# Altium project Argon_RevB_PCBA.PrjPcb (part 2 of 2)

## Sheet Display Driver.SchDoc
size B
Used 9 times, as channels D1, D2, D3, D4, D5, D6, D7, D8, D9. Parts and nets are listed once, with the designators drawn on the sheet.
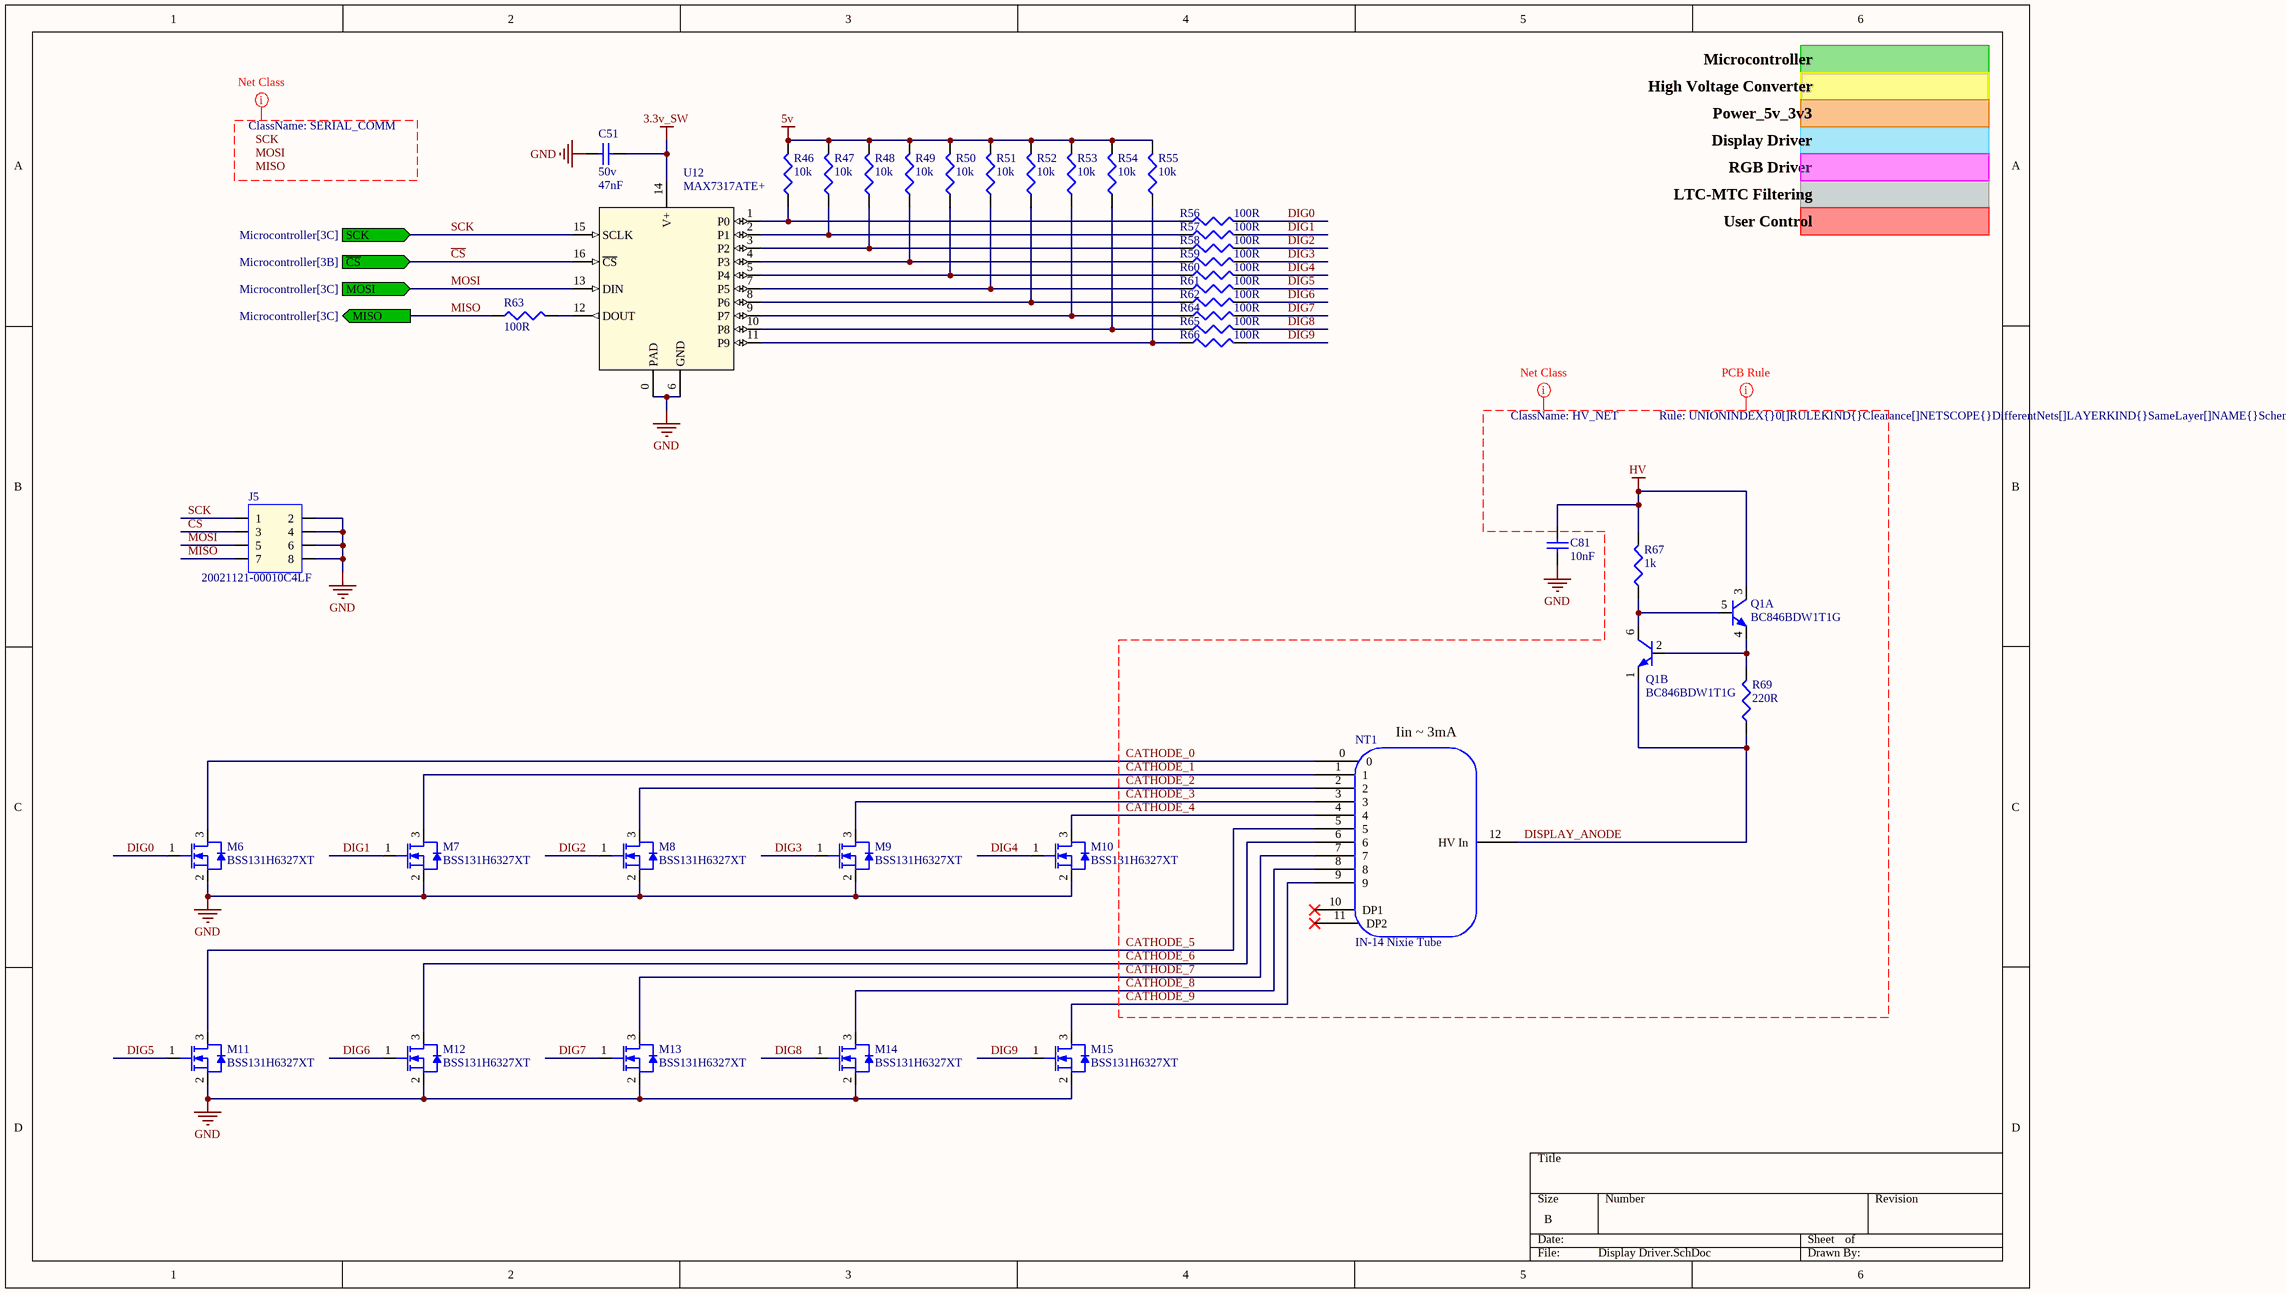
[diagram p8: Display Driver.SchDoc]

### Parts
C51  Voltage: 50v  [CAP0603R]  (hidden comment: 47nF)
C81  10nF  [CAP0805R]
J5  20021121-00010C4LF  [2x4 SMD Header 1.27mm]
M6  BSS131H6327XT  [SOT23-3 REFLOW]
M7  BSS131H6327XT  [SOT23-3 REFLOW]
M8  BSS131H6327XT  [SOT23-3 REFLOW]
M9  BSS131H6327XT  [SOT23-3 REFLOW]
M10  BSS131H6327XT  [SOT23-3 REFLOW]
M11  BSS131H6327XT  [SOT23-3 REFLOW]
M12  BSS131H6327XT  [SOT23-3 REFLOW]
M13  BSS131H6327XT  [SOT23-3 REFLOW]
M14  BSS131H6327XT  [SOT23-3 REFLOW]
M15  BSS131H6327XT  [SOT23-3 REFLOW]
NT1  IN-14 Nixie Tube  [IN-14 Nixie Tube]
Q1  BC846BDW1T1G  [SC70]  (parts A,B of 2)
R46  10k  [RES0402R]
R47  10k  [RES0402R]
R48  10k  [RES0402R]
R49  10k  [RES0402R]
R50  10k  [RES0402R]
R51  10k  [RES0402R]
R52  10k  [RES0402R]
R53  10k  [RES0402R]
R54  10k  [RES0402R]
R55  10k  [RES0402R]
R56  100R  [RES0402R]
R57  100R  [RES0402R]
R58  100R  [RES0402R]
R59  100R  [RES0402R]
R60  100R  [RES0402R]
R61  100R  [RES0402R]
R62  100R  [RES0402R]
R63  100R  [RES0402R]
R64  100R  [RES0402R]
R65  100R  [RES0402R]
R66  100R  [RES0402R]
R67  1k  [RES0402R]
R69  220R  [RES0603R]
U12  MAX7317ATE+  [TQFN-16]

### Ports
MISO (out, see Microcontroller[3C]), MOSI (in, see Microcontroller[3C]), SCK (in, see Microcontroller[3C]), ~{CS} (in, see Microcontroller[3B])

### Nets
3.3v_SW: C51.2 U12.14(V+)
5v: R46.2 R47.2 R48.2 R49.2 R50.2 R51.2 R52.2 R53.2 R54.2 R55.2
GND: C51.1 C81.2 J5.2 J5.4 J5.6 J5.8 M6.2(SOURCE) M7.2(SOURCE) M8.2(SOURCE) M9.2(SOURCE) M10.2(SOURCE) M11.2(SOURCE) M12.2(SOURCE) M13.2(SOURCE) M14.2(SOURCE) M15.2(SOURCE) U12.0(PAD) U12.6(GND)
HV: C81.1 Q1.3(E1) R67.2
~{CS}: J5.3 U12.16(~{CS}) ; port ~{CS}
CATHODE_0: M6.3(DRAIN) NT1.0
CATHODE_1: M7.3(DRAIN) NT1.1
CATHODE_2: M8.3(DRAIN) NT1.2
CATHODE_3: M9.3(DRAIN) NT1.3
CATHODE_4: M10.3(DRAIN) NT1.4
CATHODE_5: M11.3(DRAIN) NT1.5
CATHODE_6: M12.3(DRAIN) NT1.6
CATHODE_7: M13.3(DRAIN) NT1.7
CATHODE_8: M14.3(DRAIN) NT1.8
CATHODE_9: M15.3(DRAIN) NT1.9
DIG0: M6.1(GATE) R56.2
DIG1: M7.1(GATE) R57.2
DIG2: M8.1(GATE) R58.2
DIG3: M9.1(GATE) R59.2
DIG4: M10.1(GATE) R60.2
DIG5: M11.1(GATE) R61.2
DIG6: M12.1(GATE) R62.2
DIG7: M13.1(GATE) R64.2
DIG8: M14.1(GATE) R65.2
DIG9: M15.1(GATE) R66.2
DISPLAY_ANODE: NT1.12(HV_In) Q1.1(C2) R69.1
MISO: J5.7 R63.1 ; port MISO
MOSI: J5.5 U12.13(DIN) ; port MOSI
SCK: J5.1 U12.15(SCLK) ; port SCK
NetQ1_2: Q1.2(B2) Q1.4(C1) R69.2
NetQ1_5: Q1.5(B1) Q1.6(E2) R67.1
NetR46_1: R46.1 R56.1 U12.1(P0)
NetR47_1: R47.1 R57.1 U12.2(P1)
NetR48_1: R48.1 R58.1 U12.3(P2)
NetR49_1: R49.1 R59.1 U12.4(P3)
NetR50_1: R50.1 R60.1 U12.5(P4)
NetR51_1: R51.1 R61.1 U12.7(P5)
NetR52_1: R52.1 R62.1 U12.8(P6)
NetR53_1: R53.1 R64.1 U12.9(P7)
NetR54_1: R54.1 R65.1 U12.10(P8)
NetR55_1: R55.1 R66.1 U12.11(P9)
NetR63_2: R63.2 U12.12(DOUT)

Not connected (* = marked no-connect by the designer): NT1 10(DP1)* 11(DP2)*

### Channels
D1: designators end in .1; ports MISO=MISO MOSI=MOSI SCK=SCK ~{CS}=~{CS}_D1
D2: designators end in .2; ports MISO=MISO MOSI=MOSI SCK=SCK ~{CS}=~{CS}_D2
D3: designators end in .3; ports MISO=MISO MOSI=MOSI SCK=SCK ~{CS}=~{CS}_D3
D4: designators end in .4; ports MISO=MISO MOSI=MOSI SCK=SCK ~{CS}=~{CS}_D4
D5: designators end in .5; ports MISO=MISO MOSI=MOSI SCK=SCK ~{CS}=~{CS}_D5
D6: designators end in .6; ports MISO=MISO MOSI=MOSI SCK=SCK ~{CS}=~{CS}_D6
D7: designators end in .7; ports MISO=MISO MOSI=MOSI SCK=SCK ~{CS}=~{CS}_D7
D8: designators end in .8; ports MISO=MISO MOSI=MOSI SCK=SCK ~{CS}=~{CS}_D8
D9: designators end in .9; ports MISO=MISO MOSI=MOSI SCK=SCK ~{CS}=~{CS}_D9

### Layout directives
net class HV_NET: CATHODE_0, CATHODE_1, CATHODE_2, CATHODE_3, CATHODE_4, CATHODE_5, CATHODE_6, CATHODE_7, CATHODE_8, CATHODE_9, DISPLAY_ANODE, HV
rule Clearance Constraint [Clearance = 10mil]: CATHODE_0, CATHODE_1, CATHODE_2, CATHODE_3, CATHODE_4, CATHODE_5, CATHODE_6, CATHODE_7, CATHODE_8, CATHODE_9, DISPLAY_ANODE, HV
net class SERIAL_COMM: MISO, MOSI, SCK

### Notes on the sheet
- Microcontroller
- High Voltage Converter
- Display Driver
- Power_5v_3v3
- RGB Driver
- LTC-MTC Filtering
- User Control
- (near NT1) Iin ~ 3mA
- Labels drawn without touching a wire or pin: MISO, MOSI, SCK

### Library data of the parts
C51 = 47nF 50v (0603): Tolerance: 10%; MFG_PN: VJ0603Y473KXACW1BC; MFG: VISHAY; Value: 47nF
C81 = 10nF 250v (0805): Tolerance: 10%; MFG_PN: GRM21BR72E103KW03L; MFG: Murata; Voltage: 250v; LOAD: NL; Value: 10nF
J5 = 2x4 Header SMD (1.27mm): LOAD: NL; MFG: FCI; CURRENT: 1A; MFG_PN: 20021121-00010C4LF
M6-M15 = BSS131H6327XT: NFET_SINGLE_100mA_240v; MFG: INFINEON; VDS: 240v; VGS: 20v; RDS: 14R; CURRENT: 0.1A; MFG_PN: BSS131H6327XT
Q1 = BC846BDW1T1G: BJT, Dual NPN, 65v, 100mA; MFG: ON Semiconductor; VCBO: 80v; MFG_PN: BC846BDW1T1G; CURRENT: 100mA; VCEO: 65V
R46-R55 = 10k (0402): as R2 on sheet Microcontroller; Value: 10k
R56-R66 = 100R (0402): as R4 on sheet Microcontroller; Value: 100R
R67 = 1k (0402): as R86 on sheet Microcontroller; Value: 1k
R69 = 220R (0603): Tolerance: 1%; POWER: 0.1W; MFG_PN: CRCW0603220RFKEB; MFG: Vishay; Load: NL; Value: 220R
U12 = MAX7317ATE+: Port Expander, 10-bit, SPI; MFG: MAXIM; CHANNELS: 10; V_SUPPLY: 3.6v; VOUT_MAX: 7v; IOUT: 24mA; MFG_PN: MAX7317ATE+; COMMUNICATION: SPI

## Sheet RGB Driver.SchDoc
size B
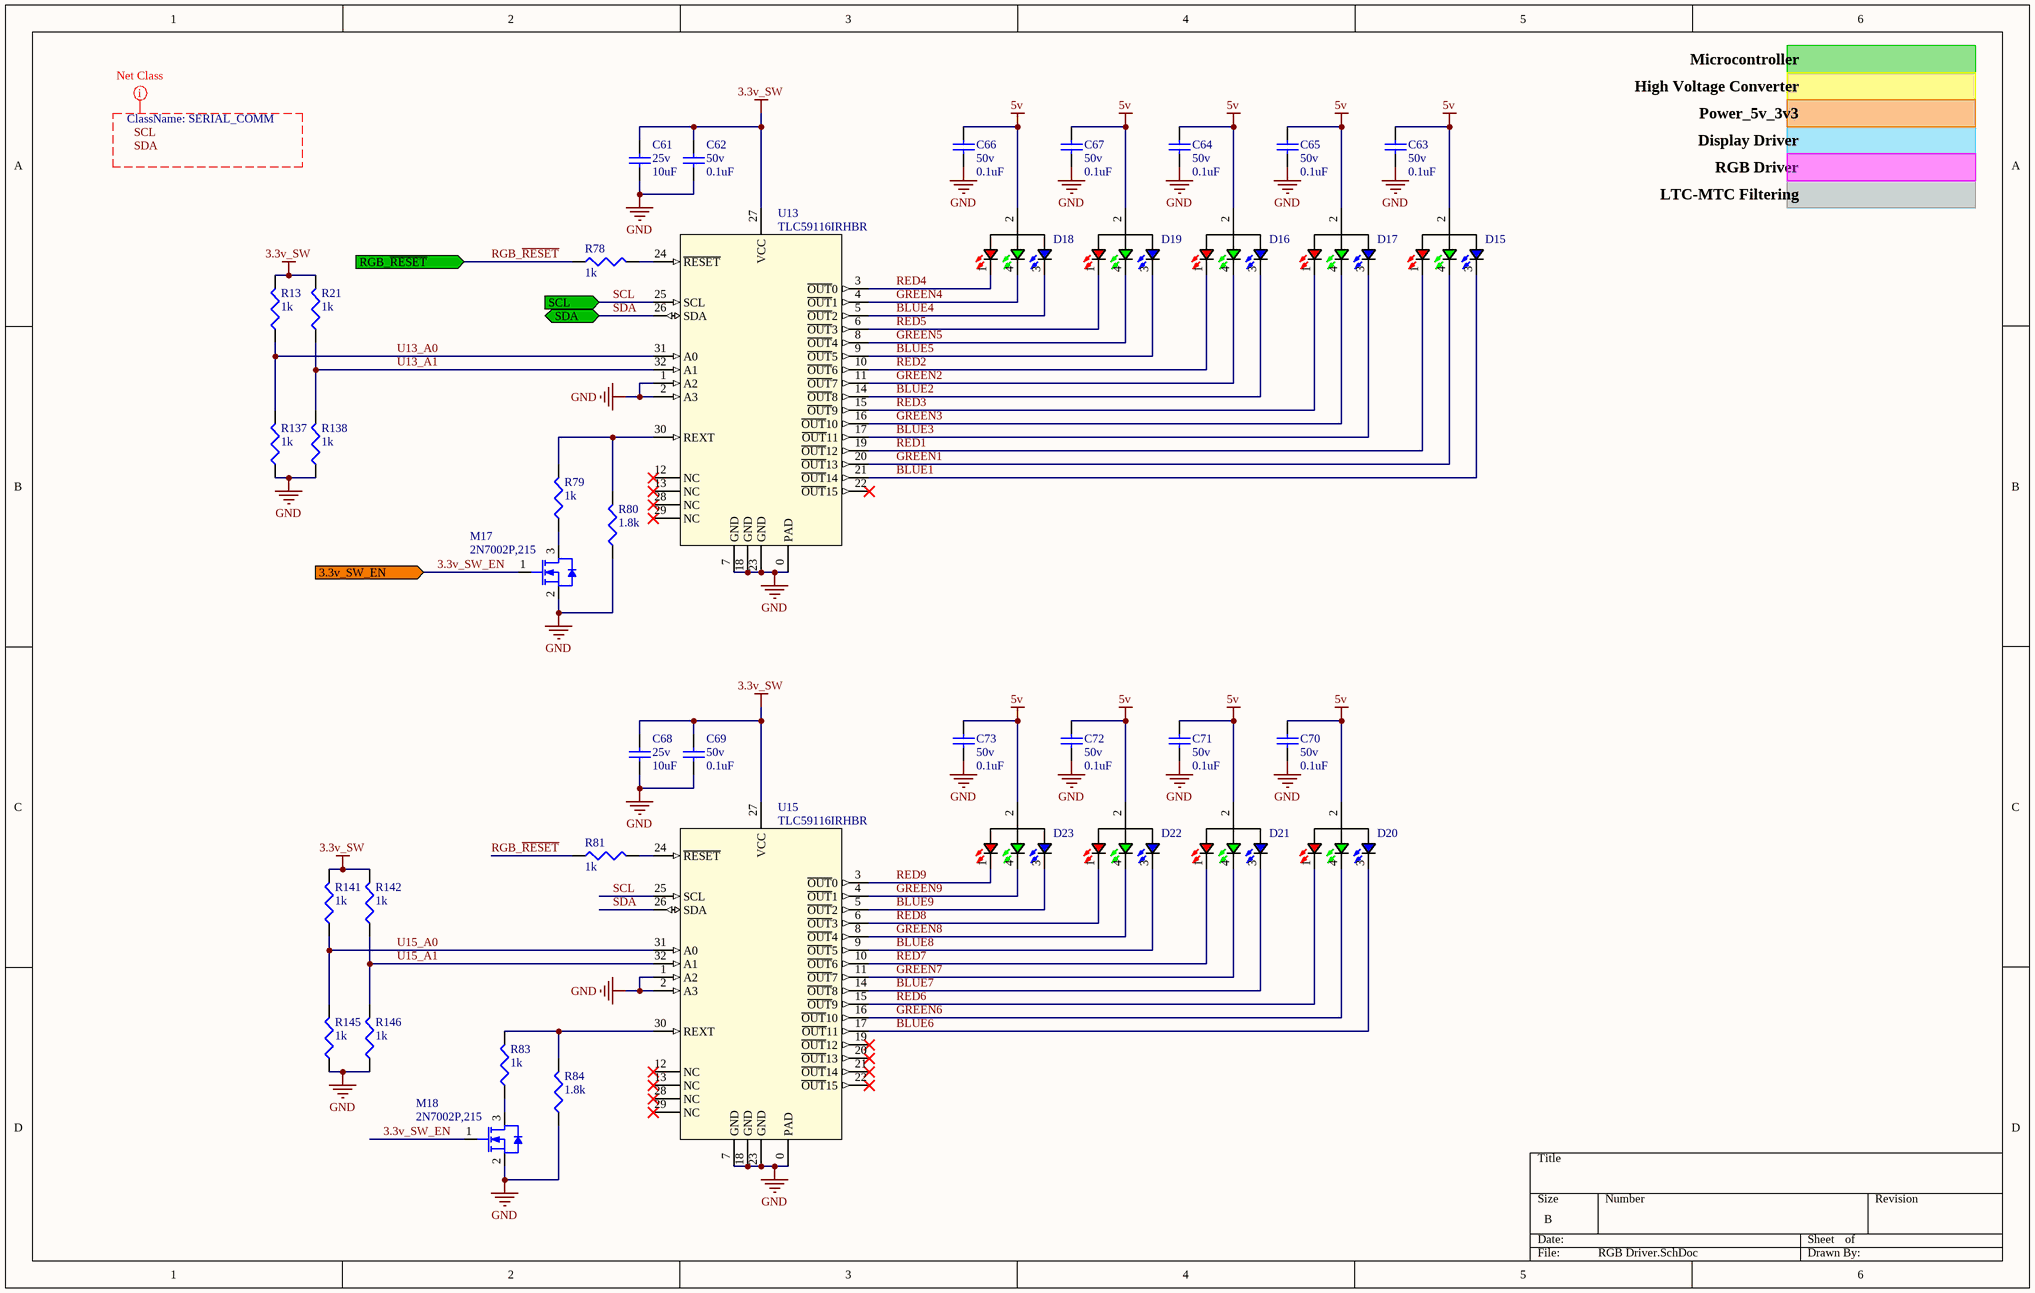
[diagram p9: RGB Driver.SchDoc]

### Parts
C61  Voltage: 25v  [CAP1206R]  (hidden comment: 10uF)
C62  Voltage: 50v  [CAP0603R]  (hidden comment: 0.1uF)
C63  Voltage: 50v  [CAP0603R]  (hidden comment: 0.1uF)
C64  Voltage: 50v  [CAP0603R]  (hidden comment: 0.1uF)
C65  Voltage: 50v  [CAP0603R]  (hidden comment: 0.1uF)
C66  Voltage: 50v  [CAP0603R]  (hidden comment: 0.1uF)
C67  Voltage: 50v  [CAP0603R]  (hidden comment: 0.1uF)
C68  Voltage: 25v  [CAP1206R]  (hidden comment: 10uF)
C69  Voltage: 50v  [CAP0603R]  (hidden comment: 0.1uF)
C70  Voltage: 50v  [CAP0603R]  (hidden comment: 0.1uF)
C71  Voltage: 50v  [CAP0603R]  (hidden comment: 0.1uF)
C72  Voltage: 50v  [CAP0603R]  (hidden comment: 0.1uF)
C73  Voltage: 50v  [CAP0603R]  (hidden comment: 0.1uF)
D15  XZMDKCBDDG45S-9  [XZMDKCBDDG45S-9]  (value not drawn)
D16  XZMDKCBDDG45S-9  [XZMDKCBDDG45S-9]  (value not drawn)
D17  XZMDKCBDDG45S-9  [XZMDKCBDDG45S-9]  (value not drawn)
D18  XZMDKCBDDG45S-9  [XZMDKCBDDG45S-9]  (value not drawn)
D19  XZMDKCBDDG45S-9  [XZMDKCBDDG45S-9]  (value not drawn)
D20  XZMDKCBDDG45S-9  [XZMDKCBDDG45S-9]  (value not drawn)
D21  XZMDKCBDDG45S-9  [XZMDKCBDDG45S-9]  (value not drawn)
D22  XZMDKCBDDG45S-9  [XZMDKCBDDG45S-9]  (value not drawn)
D23  XZMDKCBDDG45S-9  [XZMDKCBDDG45S-9]  (value not drawn)
M17  2N7002P,215  [SOT23-3M]
M18  2N7002P,215  [SOT23-3M]
R13  1k  [RES0402R]
R21  1k  [RES0402R]
R78  1k  [RES0402R]
R79  1k  [RES0402R]
R80  1.8k  [RES0402R]
R81  1k  [RES0402R]
R83  1k  [RES0402R]
R84  1.8k  [RES0402R]
R137  1k  [RES0402R]
R138  1k  [RES0402R]
R141  1k  [RES0402R]
R142  1k  [RES0402R]
R145  1k  [RES0402R]
R146  1k  [RES0402R]
U13  TLC59116IRHBR  [QFN32]
U15  TLC59116IRHBR  [QFN32]

### Ports
3.3v_SW_EN (in), RGB_~{RESET} (in), SCL (in), SDA (bidir)

### Nets
3.3v_SW: C61.1 C62.2 C68.1 C69.2 R13.2 R21.2 R141.2 R142.2 U13.27(VCC) U15.27(VCC)
5v: C63.1 C64.1 C65.1 C66.1 C67.1 C70.1 C71.1 C72.1 C73.1 D15.2(COMMON) D16.2(COMMON) D17.2(COMMON) D18.2(COMMON) D19.2(COMMON) D20.2(COMMON) D21.2(COMMON) D22.2(COMMON) D23.2(COMMON)
GND: C61.2 C62.1 C63.2 C64.2 C65.2 C66.2 C67.2 C68.2 C69.1 C70.2 C71.2 C72.2 C73.2 M17.2(SOURCE) M18.2(SOURCE) R80.1 R84.1 R137.1 R138.1 R145.1 R146.1 U13.0(PAD) U13.1(A2) U13.2(A3) U13.7(GND) U13.18(GND) U13.23(GND) U15.0(PAD) U15.1(A2) U15.2(A3) U15.7(GND) U15.18(GND) U15.23(GND)
3.3v_SW_EN: M17.1(GATE) M18.1(GATE) ; port 3.3v_SW_EN
BLUE1: D15.3(B) U13.21(~{OUT}14)
BLUE2: D16.3(B) U13.14(~{OUT}8)
BLUE3: D17.3(B) U13.17(~{OUT}11)
BLUE4: D18.3(B) U13.5(~{OUT}2)
BLUE5: D19.3(B) U13.9(~{OUT}5)
BLUE6: D20.3(B) U15.17(~{OUT}11)
BLUE7: D21.3(B) U15.14(~{OUT}8)
BLUE8: D22.3(B) U15.9(~{OUT}5)
BLUE9: D23.3(B) U15.5(~{OUT}2)
GREEN1: D15.4(G) U13.20(~{OUT}13)
GREEN2: D16.4(G) U13.11(~{OUT}7)
GREEN3: D17.4(G) U13.16(~{OUT}10)
GREEN4: D18.4(G) U13.4(~{OUT}1)
GREEN5: D19.4(G) U13.8(~{OUT}4)
GREEN6: D20.4(G) U15.16(~{OUT}10)
GREEN7: D21.4(G) U15.11(~{OUT}7)
GREEN8: D22.4(G) U15.8(~{OUT}4)
GREEN9: D23.4(G) U15.4(~{OUT}1)
RED1: D15.1(R) U13.19(~{OUT}12)
RED2: D16.1(R) U13.10(~{OUT}6)
RED3: D17.1(R) U13.15(~{OUT}9)
RED4: D18.1(R) U13.3(~{OUT}0)
RED5: D19.1(R) U13.6(~{OUT}3)
RED6: D20.1(R) U15.15(~{OUT}9)
RED7: D21.1(R) U15.10(~{OUT}6)
RED8: D22.1(R) U15.6(~{OUT}3)
RED9: D23.1(R) U15.3(~{OUT}0)
RGB_~{RESET}: R78.1 R81.1 ; port RGB_~{RESET}
SCL: U13.25(SCL) U15.25(SCL) ; port SCL
SDA: U13.26(SDA) U15.26(SDA) ; port SDA
U13_A0: R13.1 R137.2 U13.31(A0)
U13_A1: R21.1 R138.2 U13.32(A1)
U15_A0: R141.1 R145.2 U15.31(A0)
U15_A1: R142.1 R146.2 U15.32(A1)
NetM17_3: M17.3(DRAIN) R79.1
NetM18_3: M18.3(DRAIN) R83.1
NetR78_2: R78.2 U13.24(~{RESET})
NetR79_2: R79.2 R80.2 U13.30(REXT)
NetR81_2: R81.2 U15.24(~{RESET})
NetR83_2: R83.2 R84.2 U15.30(REXT)

Not connected (* = marked no-connect by the designer): U13 12(NC)* 13(NC)* 22(~{OUT}15)* 28(NC)* 29(NC)*; U15 12(NC)* 13(NC)* 19(~{OUT}12)* 20(~{OUT}13)* 21(~{OUT}14)* 22(~{OUT}15)* 28(NC)* 29(NC)*

### Layout directives
net class SERIAL_COMM: SCL, SDA

### Notes on the sheet
- Microcontroller
- High Voltage Converter
- Display Driver
- Power_5v_3v3
- RGB Driver
- LTC-MTC Filtering
- Labels drawn without touching a wire or pin: SCL, SDA

### Library data of the parts
C61 C68 = 10uF 25v (1206): Tolerance: 10%; MFG_PN: GRJ31CR71E106KE11L; MFG: MURATA; LOAD: NL; Value: 10uF
C62-C67 C69-C73 = 0.1uF 50v (0603): MFG_PN: VJ0603V104ZXAPW1BC; MFG: Vishay; LOAD: NL; Value: 0.1uF
D15-D23 = XZMDKCBDDG45S-9: Reverse Gullwing RGB LED; MFG: SUN LED; VOLTAGE RED: 1.95v; VOLTAGE GREEN: 3.3v; CURRENT: 30mA; MFG_PN: XZMDKCBDDG45S-9; VOLTAGE BLUE: 3.3v
M17 M18 = 2N7002: NFET_SINGLE_360mA_60V; LOAD: NL; MFG: NXP; VDS_MAX: 60v; I_MAX: 360mA; VGS_MAX: 20v; P_MAX: *; RDS_ON: *; MFG_PN: 2N7002P,215
R13 R21 R78 R79 R81 R83 R137 R138 R141 R142 R145 R146 = 1k (0402): Tolerance: 1%; POWER: 63mW; MFG_PN: CRCW04021K00FKED; MFG: Vishay; Load: NL; Value: 1k
R80 R84 = 1.8k (0402): Tolerance: 1%; POWER: 63mW; MFG_PN: CRCW04021K80FKED; MFG: Vishay; Load: NL; Value: 1.8k
U13 U15 = TLC59116IRHBR: LED Driver, 16ch, Individual dimming; MFG: TI; CHANNELS: 16; CURRENT: 120mA; COMM: I2C; MFG_PN: TLC59116IRHBR

## Sheet LTC-MTC Filtering.SchDoc
size B
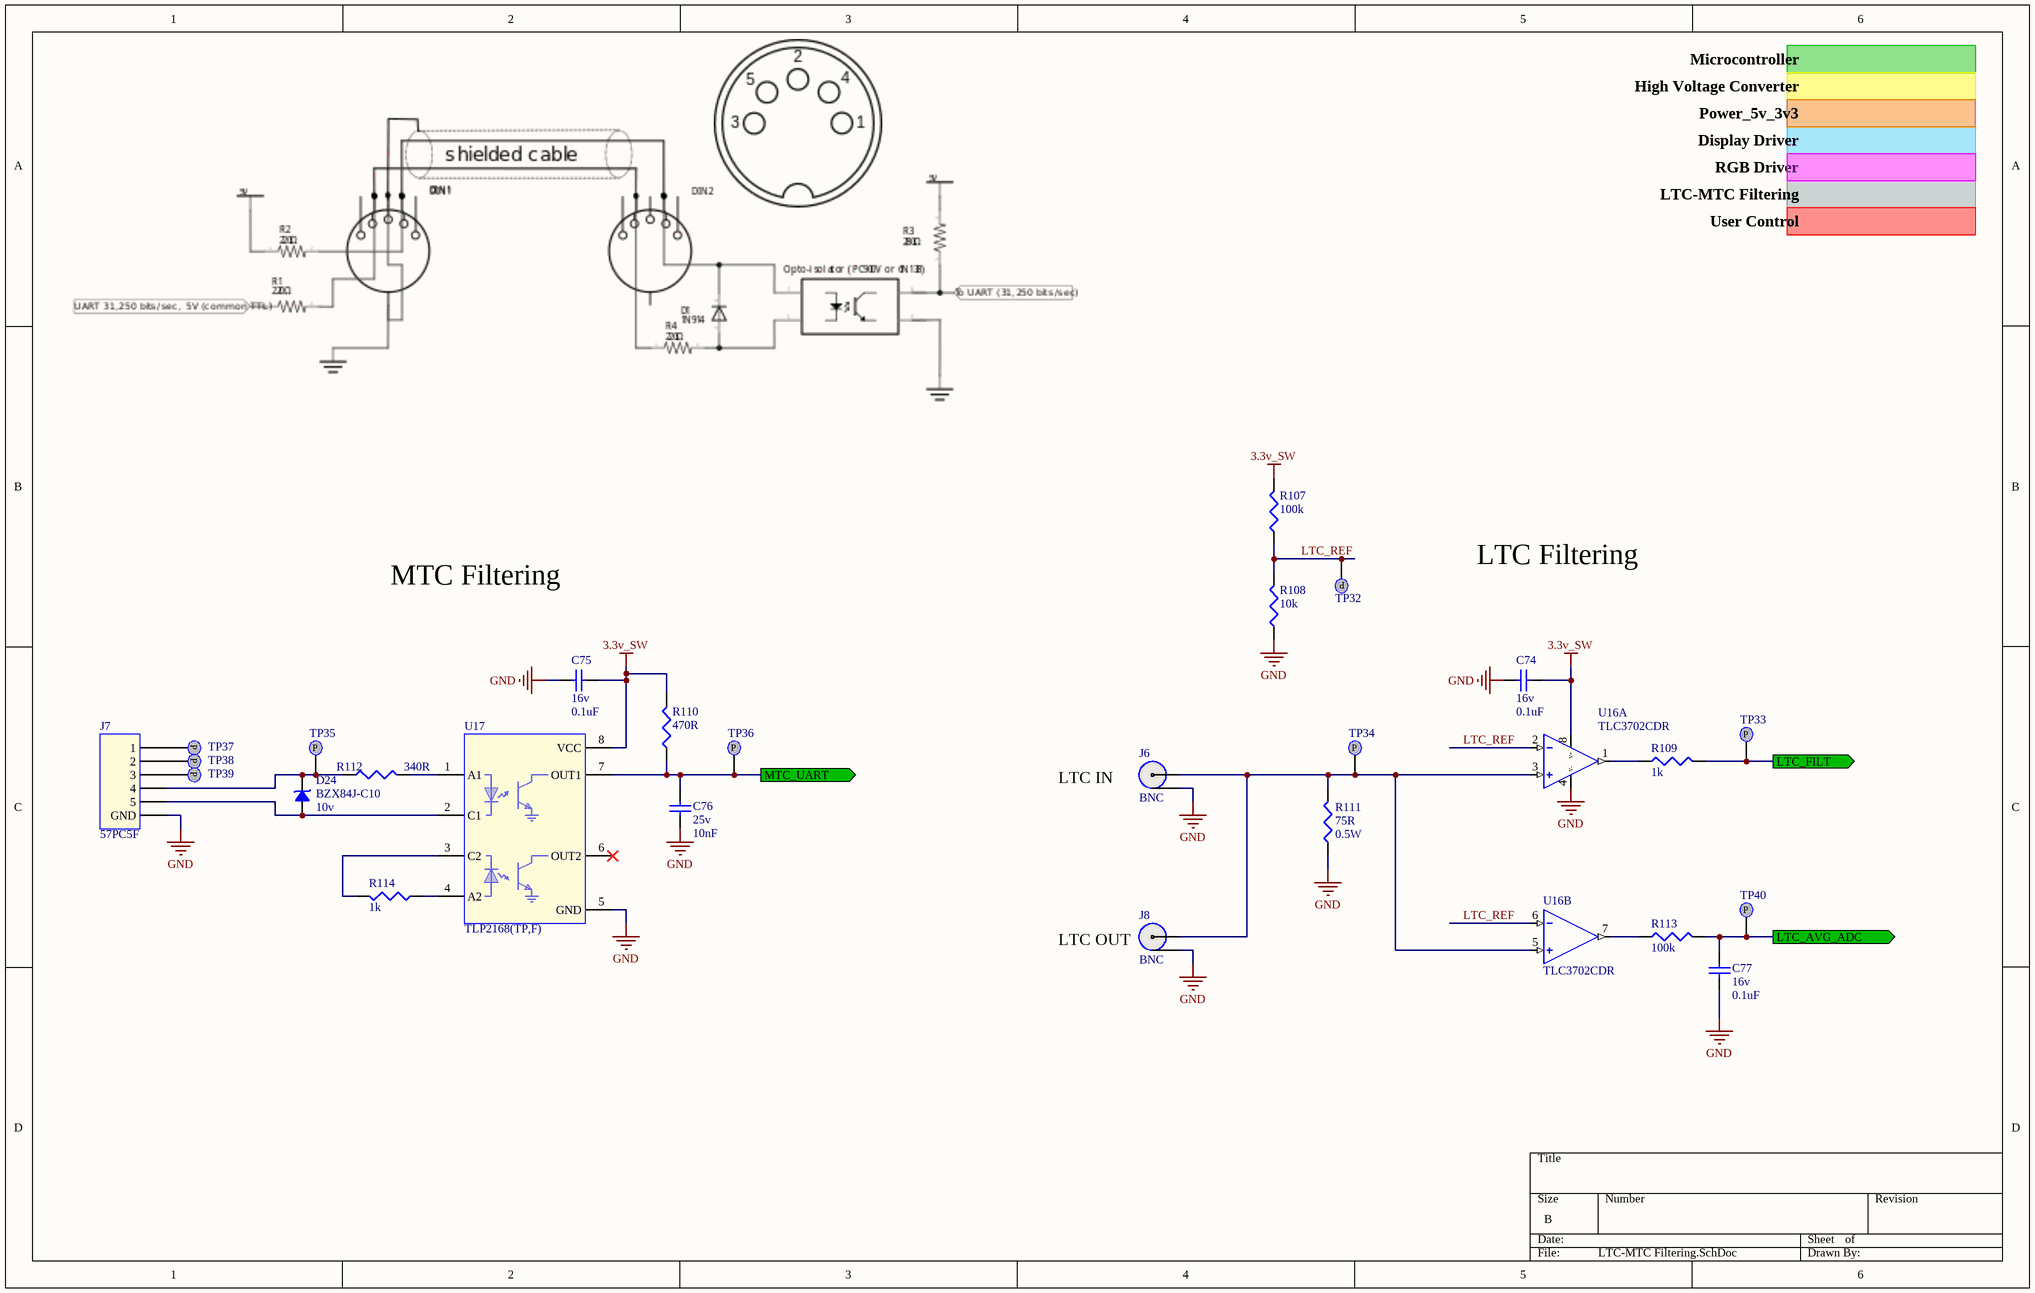
[diagram p10: LTC-MTC Filtering.SchDoc]

### Parts
C74  Voltage: 16v  [CAP0603R]  (hidden comment: 0.1uF)
C75  Voltage: 16v  [CAP0603R]  (hidden comment: 0.1uF)
C76  Voltage: 25v  [CAP0402R]  (hidden comment: 10nF)
C77  Voltage: 16v  [CAP0603R]  (hidden comment: 0.1uF)
D24  BZX84J-C10  OPER_VOLTAGE: 10v  [SOD-323 (SC-90)]
J6  BNC  [BNC Connector]
J7  57PC5F  [57PC5F]
J8  BNC  [BNC Connector]
R107  100k  [RES0402R]
R108  10k  [RES0402R]
R109  1k  [RES0402R]
R110  470R  [RES0603R]
R111  POWER: 0.5W  [RES1210R]  (hidden comment: 75R)
R112  340R  [RES0603R]
R113  100k  [RES0402R]
R114  1k  [RES0402R]
TP32  NONE  [TESTPOINT - 1.5mm Round Pad]  (value not drawn)
TP33  NONE  [TESTPOINT - 1.5mm Round Pad]  (value not drawn)
TP34  NONE  [TESTPOINT - 1.5mm Round Pad]  (value not drawn)
TP35  NONE  [TESTPOINT - 1.5mm Round Pad]  (value not drawn)
TP36  NONE  [TESTPOINT - 1.5mm Round Pad]  (value not drawn)
TP37  NONE  [TESTPOINT - 1.5mm Round Pad]  (value not drawn)
TP38  NONE  [TESTPOINT - 1.5mm Round Pad]  (value not drawn)
TP39  NONE  [TESTPOINT - 1.5mm Round Pad]  (value not drawn)
TP40  NONE  [TESTPOINT - 1.5mm Round Pad]  (value not drawn)
U16  TLC3702CDR  [SOIC-8]  (parts A,B of 2)
U17  TLP2168(TP,F)  [SOIC-8]

### Ports
LTC_AVG_ADC (out), LTC_FILT (out), MTC_UART (out)

### Nets
3.3v_SW: C74.2 C75.2 R107.2 R110.2 U16.8(V+) U17.8(VCC)
GND: C74.1 C75.1 C76.2 C77.2 J6.2 J7.6(GND) J8.2 R108.1 R111.1 U16.4(V-) U17.5(GND)
LTC_REF: R107.1 R108.2 TP32.1 U16.2(-IN_A) U16.6(-IN_B)
NetC76_1: C76.1 R110.1 TP36.1 U17.7(OUT1) ; port MTC_UART
NetC77_1: C77.1 R113.2 TP40.1 ; port LTC_AVG_ADC
NetD24_1: D24.1(K) J7.4 R112.1 TP35.1
NetD24_2: D24.2(A) J7.5 U17.2(C1)
NetJ6_1: J6.1 J8.1 R111.2 TP34.1 U16.3(+IN_A) U16.5(+IN_B)
NetJ7_1: J7.1 TP37.1
NetJ7_2: J7.2 TP38.1
NetJ7_3: J7.3 TP39.1
NetR109_1: R109.1 U16.1(OUT_A)
NetR109_2: R109.2 TP33.1 ; port LTC_FILT
NetR112_2: R112.2 U17.1(A1)
NetR113_1: R113.1 U16.7(OUT_B)
NetR114_1: R114.1 U17.4(A2)
NetR114_2: R114.2 U17.3(C2)

Not connected (* = marked no-connect by the designer): U17 6(OUT2)*

### Notes on the sheet
- Microcontroller
- High Voltage Converter
- Display Driver
- Power_5v_3v3
- RGB Driver
- LTC-MTC Filtering
- User Control
- LTC Filtering
- MTC Filtering
- (near J6) LTC IN
- (near J8) LTC OUT
- (in symbol Testpoint 1.5mm Pad) P

### Library data of the parts
C74 C75 C77 = 0.1uF 16v (0603): MFG_PN: VJ0603Y104JXJPW1BC; MFG: Vishay; LOAD: NL; Value: 0.1uF
C76 = 10nF 25v (0402): Tolerance: 5%; MFG_PN: VJ0402Y103JXXAC; MFG: Vishay; LOAD: NL; Value: 10nF
D24 = BZX84J-C10: Zener, 10v, Single; MFG: NXP; MFG_PN: BZX84J-C10
J6 J8 = BNC Connector: MFG: VITELEC; MFG_PN: VBI211
J7 = 57PC5F: 5-pin DIN Connector; MFG: SWITCHCRAFT; MFG_PN: 57PC5F
R107 R113 = 100k (0402): Tolerance: 1%; POWER: 63mW; MFG_PN: CRCW0402100KFKED; MFG: Vishay; Load: NL; Value: 100k
R108 = 10k (0402): Tolerance: 1%; POWER: 63mW; MFG_PN: CRCW040210K0FKED; MFG: Vishay; Load: NL; Value: 10k
R109 R114 = 1k (0402): as R13 on sheet RGB Driver; Value: 1k
R110 = 470R (0603): Tolerance: 1%; POWER: 0.1W; MFG_PN: CRCW0603470RFKEA; MFG: Vishay; Load: NL; Value: 470R
R111 = 75R (1210): Tolerance: 1%; MFG_PN: CRCW121075R0FKEA; MFG: Vishay; Load: NL; Value: 75R
R112 = 340R (0603): Tolerance: 1%; POWER: 0.1W; MFG_PN: CRCW0603340RFKEA; MFG: Vishay; Load: NL; Value: 340R
TP32-TP40 = Testpoint 1.5mm Pad: 1.5mm Testpoint
U16 = TLC3702CDR: Comparator, Dual, Push-Pull; LOAD: NL; MFG: TI; CHANNELS: 2; SINGLE_SUPPLY: TRUE; VMAX: 16v; OFFSET_VOLTAGE: 5mV; MFG_PN: TLC3702CDR
U17 = TLP2168(TP,F): Optocoupler, Dual, 10MBPS; MFG: TOSHIBA; RATE: 20Mbps; MFG_PN: TLP2168(TP,F)

## Sheet User Control-Sliders.SchDoc
size C
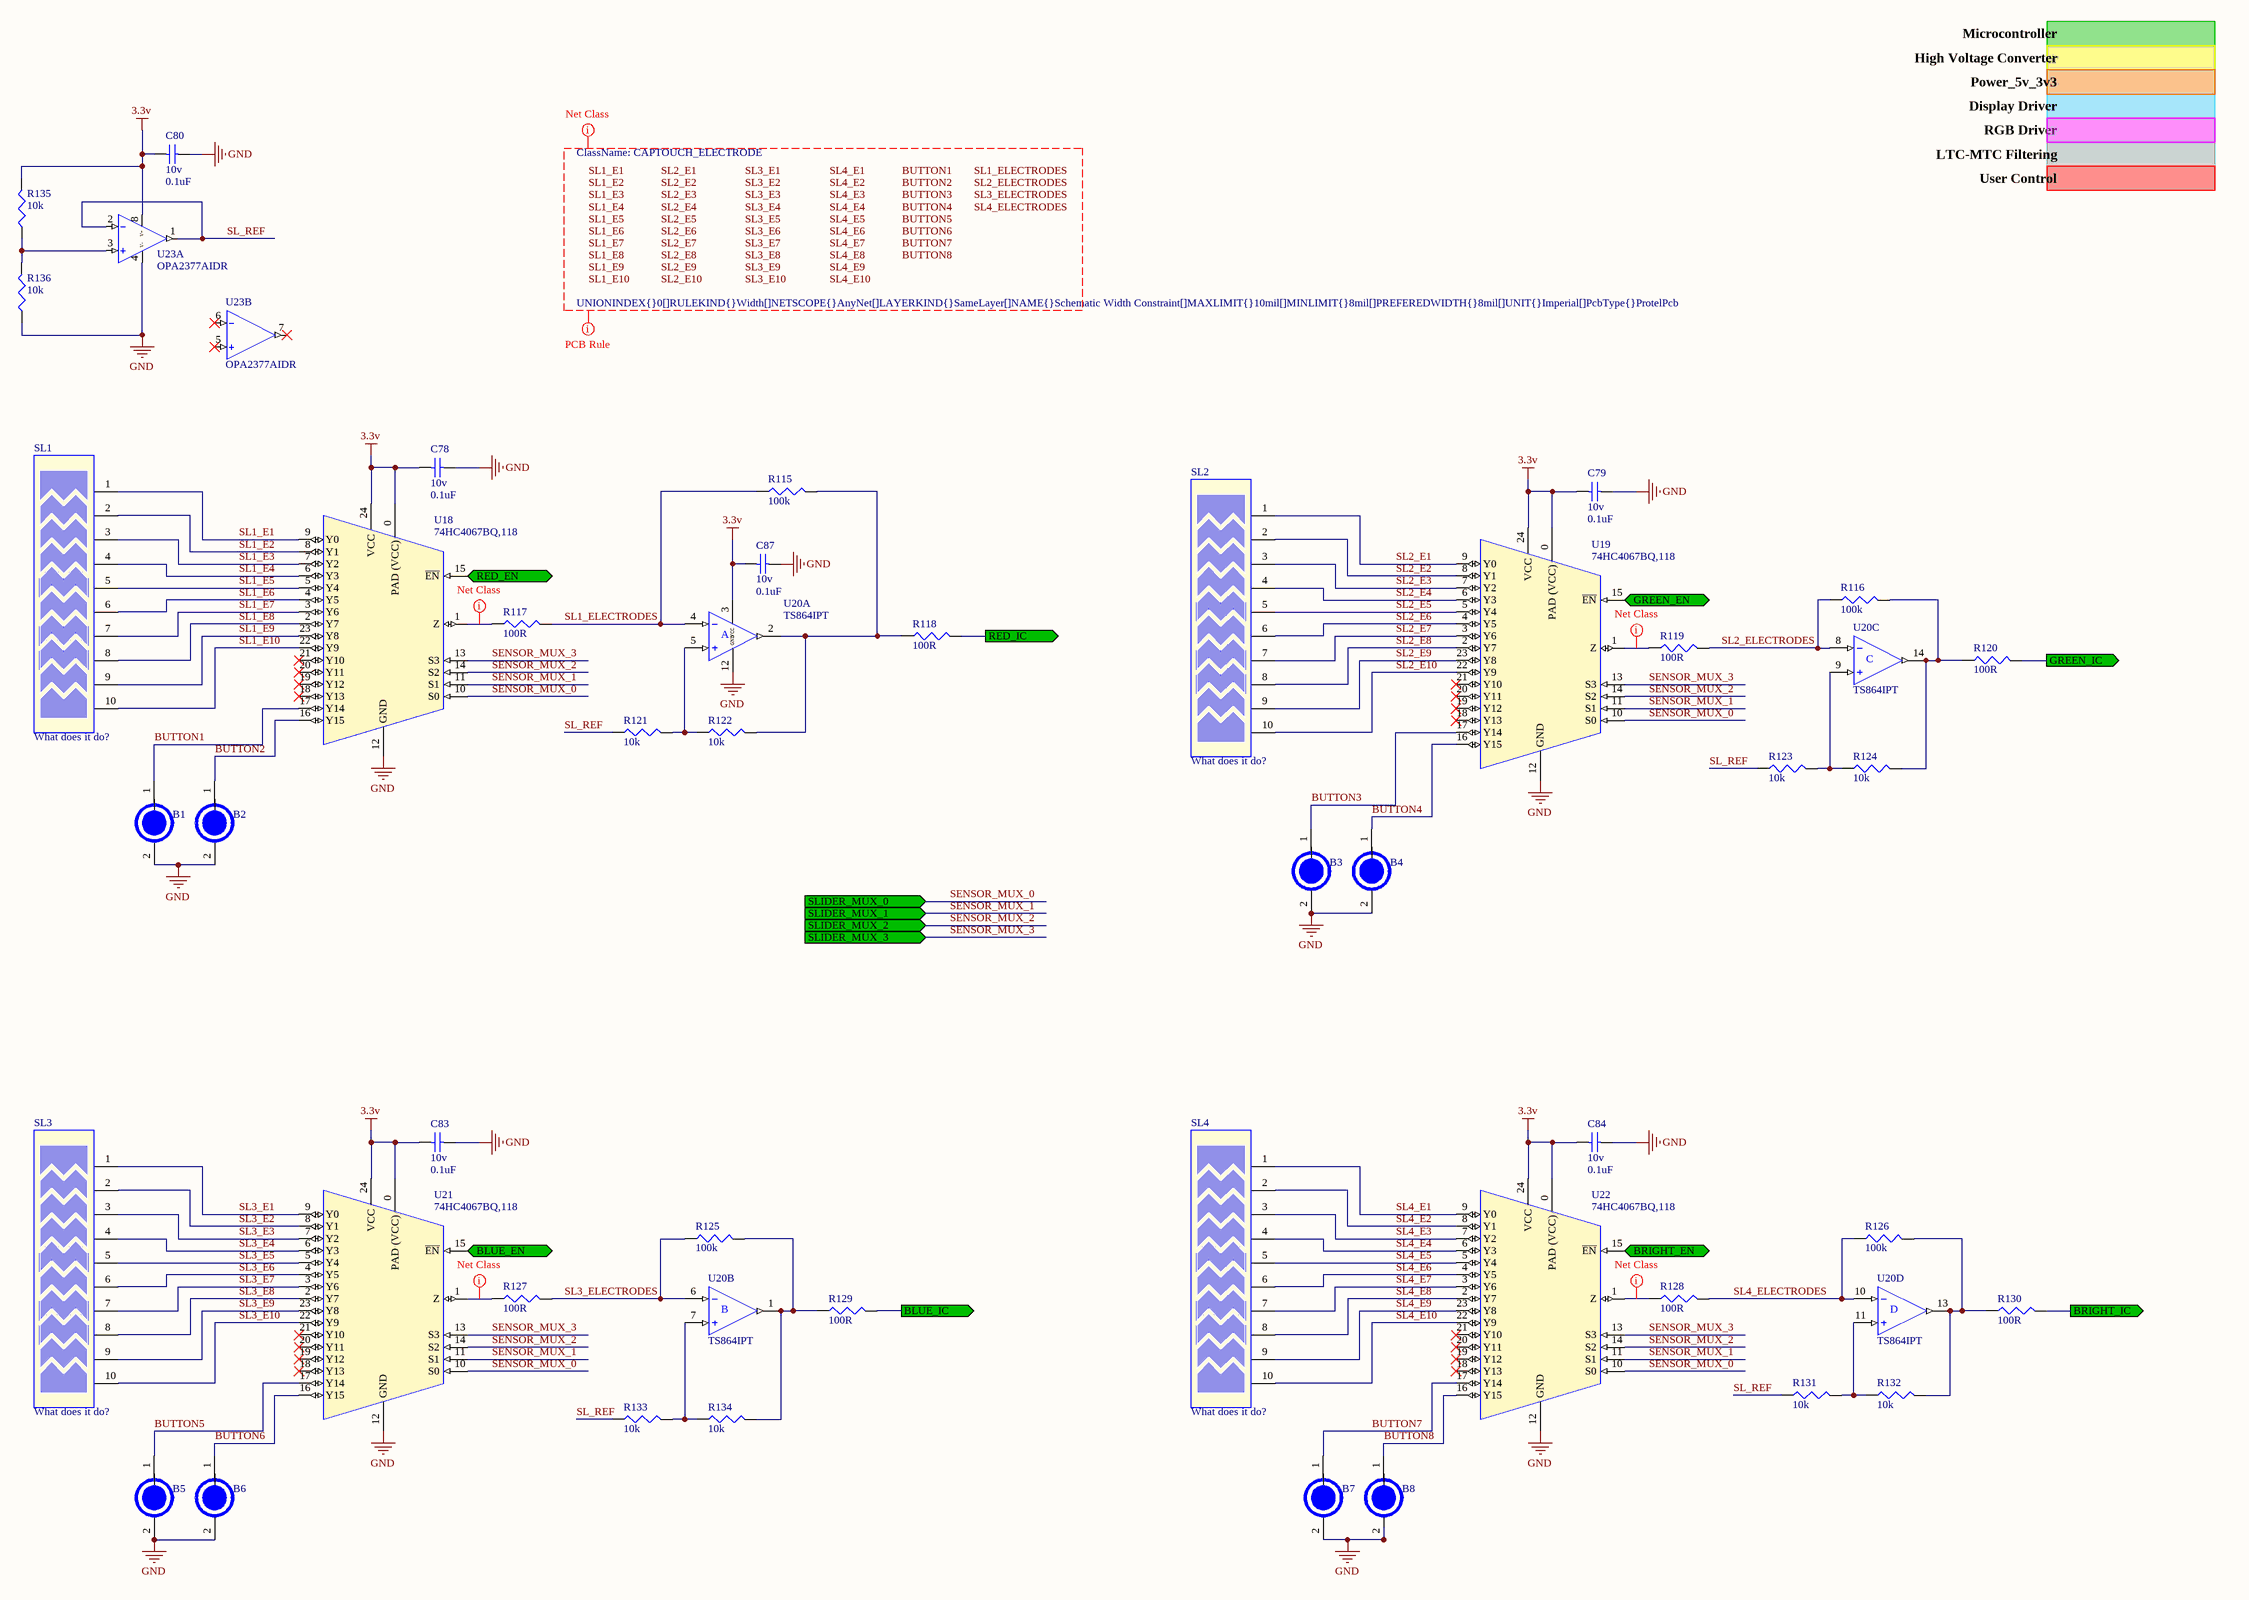
[diagram p11: User Control-Sliders.SchDoc]

### Parts
B1  Cap Touch Button  [Cap Touch Button 10mm]  (value not drawn)  (no BOM)
B2  Cap Touch Button  [Cap Touch Button 10mm]  (value not drawn)  (no BOM)
B3  Cap Touch Button  [Cap Touch Button 10mm]  (value not drawn)  (no BOM)
B4  Cap Touch Button  [Cap Touch Button 10mm]  (value not drawn)  (no BOM)
B5  Cap Touch Button  [Cap Touch Button 10mm]  (value not drawn)  (no BOM)
B6  Cap Touch Button  [Cap Touch Button 10mm]  (value not drawn)  (no BOM)
B7  Cap Touch Button  [Cap Touch Button 10mm]  (value not drawn)  (no BOM)
B8  Cap Touch Button  [Cap Touch Button 10mm]  (value not drawn)  (no BOM)
C78  Voltage: 10v  [CAP0402R]  (hidden comment: 0.1uF)
C79  Voltage: 10v  [CAP0402R]  (hidden comment: 0.1uF)
C80  Voltage: 10v  [CAP0402R]  (hidden comment: 0.1uF)
C83  Voltage: 10v  [CAP0402R]  (hidden comment: 0.1uF)
C84  Voltage: 10v  [CAP0402R]  (hidden comment: 0.1uF)
C87  Voltage: 10v  [CAP0402R]  (hidden comment: 0.1uF)
R115  100k  [RES0402R]
R116  100k  [RES0402R]
R117  100R  [RES0402R]
R118  100R  [RES0402R]
R119  100R  [RES0402R]
R120  100R  [RES0402R]
R121  10k  [RES0402R]
R122  10k  [RES0402R]
R123  10k  [RES0402R]
R124  10k  [RES0402R]
R125  100k  [RES0402R]
R126  100k  [RES0402R]
R127  100R  [RES0402R]
R128  100R  [RES0402R]
R129  100R  [RES0402R]
R130  100R  [RES0402R]
R131  10k  [RES0402R]
R132  10k  [RES0402R]
R133  10k  [RES0402R]
R134  10k  [RES0402R]
R135  10k  [RES0402R]
R136  10k  [RES0402R]
SL1  What does it do?  [Cap Slider 15x55mm]  (no BOM)
SL2  What does it do?  [Cap Slider 15x55mm]  (no BOM)
SL3  What does it do?  [Cap Slider 15x55mm]  (no BOM)
SL4  What does it do?  [Cap Slider 15x55mm]  (no BOM)
U18  74HC4067BQ,118  [SOT815-1]
U19  74HC4067BQ,118  [SOT815-1]
U20  TS864IPT  [TSSOP14]  (parts A,B,C,D of 4)
U21  74HC4067BQ,118  [SOT815-1]
U22  74HC4067BQ,118  [SOT815-1]
U23  OPA2377AIDR  [SOIC-8]  (parts A,B of 2)

### Ports
BLUE_EN (in), BLUE_IC (out), BRIGHT_EN (in), BRIGHT_IC (out), GREEN_EN (in), GREEN_IC (out), RED_EN (in), RED_IC (out), SLIDER_MUX_0 (in), SLIDER_MUX_1 (in), SLIDER_MUX_2 (in), SLIDER_MUX_3 (in)

### Nets
3.3v: C78.1 C79.1 C80.2 C83.1 C84.1 C87.1 R135.2 U18.0(PAD_(VCC)) U18.24(VCC) U19.0(PAD_(VCC)) U19.24(VCC) U20.3(VCC) U21.0(PAD_(VCC)) U21.24(VCC) U22.0(PAD_(VCC)) U22.24(VCC) U23.8(V+)
GND: B1.2(-) B2.2(-) B3.2(-) B4.2(-) B5.2(-) B6.2(-) B7.2(-) B8.2(-) C78.2 C79.2 C80.1 C83.2 C84.2 C87.2 R136.1 U18.12(GND) U19.12(GND) U20.12(GND) U21.12(GND) U22.12(GND) U23.4(V-)
BUTTON1: B1.1(+) U18.17(Y14)
BUTTON2: B2.1(+) U18.16(Y15)
BUTTON3: B3.1(+) U19.17(Y14)
BUTTON4: B4.1(+) U19.16(Y15)
BUTTON5: B5.1(+) U21.17(Y14)
BUTTON6: B6.1(+) U21.16(Y15)
BUTTON7: B7.1(+) U22.17(Y14)
BUTTON8: B8.1(+) U22.16(Y15)
SENSOR_MUX_0: U18.10(S0) U19.10(S0) U21.10(S0) U22.10(S0) ; port SLIDER_MUX_0
SENSOR_MUX_1: U18.11(S1) U19.11(S1) U21.11(S1) U22.11(S1) ; port SLIDER_MUX_1
SENSOR_MUX_2: U18.14(S2) U19.14(S2) U21.14(S2) U22.14(S2) ; port SLIDER_MUX_2
SENSOR_MUX_3: U18.13(S3) U19.13(S3) U21.13(S3) U22.13(S3) ; port SLIDER_MUX_3
SL1_E1: SL1.1 U18.9(Y0)
SL1_E2: SL1.2 U18.8(Y1)
SL1_E3: SL1.3 U18.7(Y2)
SL1_E4: SL1.4 U18.6(Y3)
SL1_E5: SL1.5 U18.5(Y4)
SL1_E6: SL1.6 U18.4(Y5)
SL1_E7: SL1.7 U18.3(Y6)
SL1_E8: SL1.8 U18.2(Y7)
SL1_E9: SL1.9 U18.23(Y8)
SL1_E10: SL1.10 U18.22(Y9)
SL1_ELECTRODES: R115.1 R117.2 U20.4(1IN-)
SL2_E1: SL2.1 U19.9(Y0)
SL2_E2: SL2.2 U19.8(Y1)
SL2_E3: SL2.3 U19.7(Y2)
SL2_E4: SL2.4 U19.6(Y3)
SL2_E5: SL2.5 U19.5(Y4)
SL2_E6: SL2.6 U19.4(Y5)
SL2_E7: SL2.7 U19.3(Y6)
SL2_E8: SL2.8 U19.2(Y7)
SL2_E9: SL2.9 U19.23(Y8)
SL2_E10: SL2.10 U19.22(Y9)
SL2_ELECTRODES: R116.1 R119.2 U20.8(3IN-)
SL3_E1: SL3.1 U21.9(Y0)
SL3_E2: SL3.2 U21.8(Y1)
SL3_E3: SL3.3 U21.7(Y2)
SL3_E4: SL3.4 U21.6(Y3)
SL3_E5: SL3.5 U21.5(Y4)
SL3_E6: SL3.6 U21.4(Y5)
SL3_E7: SL3.7 U21.3(Y6)
SL3_E8: SL3.8 U21.2(Y7)
SL3_E9: SL3.9 U21.23(Y8)
SL3_E10: SL3.10 U21.22(Y9)
SL3_ELECTRODES: R125.1 R127.2 U20.6(2IN-)
SL4_E1: SL4.1 U22.9(Y0)
SL4_E2: SL4.2 U22.8(Y1)
SL4_E3: SL4.3 U22.7(Y2)
SL4_E4: SL4.4 U22.6(Y3)
SL4_E5: SL4.5 U22.5(Y4)
SL4_E6: SL4.6 U22.4(Y5)
SL4_E7: SL4.7 U22.3(Y6)
SL4_E8: SL4.8 U22.2(Y7)
SL4_E9: SL4.9 U22.23(Y8)
SL4_E10: SL4.10 U22.22(Y9)
SL4_ELECTRODES: R126.1 R128.2 U20.10(4IN-)
SL_REF: R121.1 R123.1 R131.1 R133.1 U23.1(OUT_A) U23.2(-IN_A)
NetR115_2: R115.2 R118.1 R122.2 U20.2(1OUT)
NetR116_2: R116.2 R120.1 R124.2 U20.14(3OUT)
NetR117_1: R117.1 U18.1(Z)
NetR118_2: R118.2 ; port RED_IC
NetR119_1: R119.1 U19.1(Z)
NetR120_2: R120.2 ; port GREEN_IC
NetR121_2: R121.2 R122.1 U20.5(1IN+)
NetR123_2: R123.2 R124.1 U20.9(3IN+)
NetR125_2: R125.2 R129.1 R134.2 U20.1(2OUT)
NetR126_2: R126.2 R130.1 R132.2 U20.13(4OUT)
NetR127_1: R127.1 U21.1(Z)
NetR128_1: R128.1 U22.1(Z)
NetR129_2: R129.2 ; port BLUE_IC
NetR130_2: R130.2 ; port BRIGHT_IC
NetR131_2: R131.2 R132.1 U20.11(4IN+)
NetR133_2: R133.2 R134.1 U20.7(2IN+)
NetR135_1: R135.1 R136.2 U23.3(+IN_A)
NetU1_84: U19.15(~{EN}) ; port GREEN_EN
NetU1_85: U18.15(~{EN}) ; port RED_EN
NetU1_86: U21.15(~{EN}) ; port BLUE_EN
NetU1_87: U22.15(~{EN}) ; port BRIGHT_EN

Not connected (* = marked no-connect by the designer): U18 18(Y13)* 19(Y12)* 20(Y11)* 21(Y10)*; U19 18(Y13)* 19(Y12)* 20(Y11)* 21(Y10)*; U21 18(Y13)* 19(Y12)* 20(Y11)* 21(Y10)*; U22 18(Y13)* 19(Y12)* 20(Y11)* 21(Y10)*; U23 5(+IN_B)* 6(-IN_B)* 7(OUT_B)*

### Layout directives
net class CAPTOUCH_ELECTRODE: BUTTON1, BUTTON2, BUTTON3, BUTTON4, BUTTON5, BUTTON6, BUTTON7, BUTTON8, NetR117_1, NetR119_1, NetR127_1, NetR128_1, SL1_E1, SL1_E2, SL1_E3, SL1_E4, SL1_E5, SL1_E6, SL1_E7, SL1_E8, SL1_E9, SL1_E10, SL1_ELECTRODES, SL2_E1, SL2_E2, SL2_E3, SL2_E4, SL2_E5, SL2_E6, SL2_E7, SL2_E8, SL2_E9, SL2_E10, SL2_ELECTRODES, SL3_E1, SL3_E2, SL3_E3, SL3_E4, SL3_E5, SL3_E6, SL3_E7, SL3_E8, SL3_E9, SL3_E10, SL3_ELECTRODES, SL4_E1, SL4_E2, SL4_E3, SL4_E4, SL4_E5, SL4_E6, SL4_E7, SL4_E8, SL4_E9, SL4_E10, SL4_ELECTRODES
rule Width Constraint [Pref Width = 8mil    Min Width = 8mil    Max Width = 10mil]: BUTTON1, BUTTON2, BUTTON3, BUTTON4, BUTTON5, BUTTON6, BUTTON7, BUTTON8, SL1_E1, SL1_E2, SL1_E3, SL1_E4, SL1_E5, SL1_E6, SL1_E7, SL1_E8, SL1_E9, SL1_E10, SL1_ELECTRODES, SL2_E1, SL2_E2, SL2_E3, SL2_E4, SL2_E5, SL2_E6, SL2_E7, SL2_E8, SL2_E9, SL2_E10, SL2_ELECTRODES, SL3_E1, SL3_E2, SL3_E3, SL3_E4, SL3_E5, SL3_E6, SL3_E7, SL3_E8, SL3_E9, SL3_E10, SL3_ELECTRODES, SL4_E1, SL4_E2, SL4_E3, SL4_E4, SL4_E5, SL4_E6, SL4_E7, SL4_E8, SL4_E9, SL4_E10, SL4_ELECTRODES

### Notes on the sheet
- Microcontroller
- High Voltage Converter
- Display Driver
- Power_5v_3v3
- RGB Driver
- LTC-MTC Filtering
- User Control
- Labels drawn without touching a wire or pin: BUTTON1, BUTTON2, BUTTON3, BUTTON4, BUTTON5, BUTTON6, BUTTON7, BUTTON8, SL1_E1, SL1_E2, SL1_E3, SL1_E4, SL1_E5, SL1_E6, SL1_E7, SL1_E8, SL1_E9, SL1_E10, SL1_ELECTRODES, SL2_E1, SL2_E2, SL2_E3, SL2_E4, SL2_E5, SL2_E6, SL2_E7, SL2_E8, SL2_E9, SL2_E10, SL2_ELECTRODES, SL3_E1, SL3_E2, SL3_E3, SL3_E4, SL3_E5, SL3_E6, SL3_E7, SL3_E8, SL3_E9, SL3_E10, SL3_ELECTRODES, SL4_E1, SL4_E2, SL4_E3, SL4_E4, SL4_E5, SL4_E6, SL4_E7, SL4_E8, SL4_E9, SL4_E10, SL4_ELECTRODES
- (in symbol TS864IPT, part A) A
- (in symbol TS864IPT, part B) B
- (in symbol TS864IPT, part C) C
- (in symbol TS864IPT, part D) D

### Library data of the parts
B1-B8 = Cap Touch Button 10mm: TYPE: Cap Touch Button; SIZE: 10mm
C78-C80 C83 C84 C87 = 0.1uF 10v (0402): Tolerance: 20%; MFG_PN: VJ0402G104MXQCW1BC; MFG: Vishay; LOAD: NL; Value: 0.1uF
R115 R116 R125 R126 = 100k (0402): as R107 on sheet LTC-MTC Filtering; Value: 100k
R117-R120 R127-R130 = 100R (0402): Tolerance: 1%; POWER: 63mW; MFG_PN: CRCW0402100RFKED; MFG: Vishay; Load: NL; Value: 100R
R121-R124 R131-R136 = 10k (0402): as R108 on sheet LTC-MTC Filtering; Value: 10k
SL1-SL4 = Capacitive Slider 10-position 15x55mm: Middle Capacitance: 10.6pF; End Capacitance: 26.6pF; FUNCTION: What does it do?
U18 U19 U21 U22 = 74HC4067BQ,118: Analog MUX/DEMUX, 16-Channel, 42ns; MFG: NXP; RES: 130; INPUT_CAPACITANCE: 3.5pF; MFG_PN: 74HC4067BQ,118
U20 = TS864IPT: Compartor, Quad, 2.7-10v, 20ns; MFG: ST; CHANNELS: 4; VMAX: 10v; VMIN: 2.7v; OUTPUT: PUSH-PULL; MFG_PN: TS864IPT; RISE: 20ns
U23 = OPA2377AIDR: OpAmp - 2 Channel; LOAD: NL; MFG: TI; CHANNELS: 2; GBP: 5MHz; SINGLE_SUPPLY: TRUE; VMAX: 5.5v; OFFSET_VOLTAGE: 1mV; MFG_PN: OPA2377AIDR

## Nets that join several sheets
3.3v: Microcontroller (21 pins), Power_5v_3v3 (11 pins), High Voltage Converter (5 pins), User Control-Sliders (17 pins)
3.3v_SW: Power_5v_3v3 (C34.1 M5.2), D1 (C51.1.2 U12.1.14), D2 (C51.2.2 U12.2.14), D3 (C51.3.2 U12.3.14), D4 (C51.4.2 U12.4.14), D5 (C51.5.2 U12.5.14), D6 (C51.6.2 U12.6.14), D7 (C51.7.2 U12.7.14), D8 (C51.8.2 U12.8.14), D9 (C51.9.2 U12.9.14), RGB Driver (10 pins), LTC-MTC Filtering (6 pins)
5v: Power_5v_3v3 (D12.1 R7.2 R29.2), High Voltage Converter (9 pins), D1 (10 pins), D2 (10 pins), D3 (10 pins), D4 (10 pins), D5 (10 pins), D6 (10 pins), D7 (10 pins), D8 (10 pins), D9 (10 pins), RGB Driver (18 pins)
GND: Microcontroller (45 pins), Power_5v_3v3 (66 pins), High Voltage Converter (43 pins), D1 (18 pins), D2 (18 pins), D3 (18 pins), D4 (18 pins), D5 (18 pins), D6 (18 pins), D7 (18 pins), D8 (18 pins), D9 (18 pins), RGB Driver (33 pins), LTC-MTC Filtering (11 pins), User Control-Sliders (21 pins)
HV: High Voltage Converter (M19.2 M19.4), D1 (C81.1.1 Q1.1.3 R67.1.2), D2 (C81.2.1 Q1.2.3 R67.2.2), D3 (C81.3.1 Q1.3.3 R67.3.2), D4 (C81.4.1 Q1.4.3 R67.4.2), D5 (C81.5.1 Q1.5.3 R67.5.2), D6 (C81.6.1 Q1.6.3 R67.6.2), D7 (C81.7.1 Q1.7.3 R67.7.2), D8 (C81.8.1 Q1.8.3 R67.8.2), D9 (C81.9.1 Q1.9.3 R67.9.2)
USB_5v: Microcontroller (6 pins), Power_5v_3v3 (L4.1 R75.2)
VDC: Microcontroller (R2.2), Power_5v_3v3 (12 pins), High Voltage Converter (6 pins)
3.3v_SW_EN: Power_5v_3v3 (D14.2 J2.3 R23.1), RGB Driver (M17.1 M18.1)
HV_VSENSE_ADC: Microcontroller (U1.72), High Voltage Converter (TP18.1 U6.1 U6.2)
MISO: Microcontroller (R97.1), D1 (J5.1.7 R63.1.1), D2 (J5.2.7 R63.2.1), D3 (J5.3.7 R63.3.1), D4 (J5.4.7 R63.4.1), D5 (J5.5.7 R63.5.1), D6 (J5.6.7 R63.6.1), D7 (J5.7.7 R63.7.1), D8 (J5.8.7 R63.8.1), D9 (J5.9.7 R63.9.1)
MOSI: Microcontroller (R96.1), D1 (J5.1.5 U12.1.13), D2 (J5.2.5 U12.2.13), D3 (J5.3.5 U12.3.13), D4 (J5.4.5 U12.4.13), D5 (J5.5.5 U12.5.13), D6 (J5.6.5 U12.6.13), D7 (J5.7.5 U12.7.13), D8 (J5.8.5 U12.8.13), D9 (J5.9.5 U12.9.13)
NetC42_1: Microcontroller (U1.59), Power_5v_3v3 (C42.1 D9.3 R27.1 R32.2)
NetC76_1: Microcontroller (U1.99), LTC-MTC Filtering (C76.1 R110.1 TP36.1 U17.7)
NetC77_1: Microcontroller (U1.16), LTC-MTC Filtering (C77.1 R113.2 TP40.1)
NetR8_1: Microcontroller (R102.2), Power_5v_3v3 (R8.1)
NetR16_1: Microcontroller (R91.2), High Voltage Converter (R16.1)
NetR38_1: Microcontroller (R103.2), Power_5v_3v3 (R38.1 R39.2)
NetR76_1: Microcontroller (R104.2), Power_5v_3v3 (R76.1 R77.2)
NetR82_2: Microcontroller (R82.2), High Voltage Converter (U27.6)
NetR106_2: Microcontroller (R106.2), High Voltage Converter (U25.13)
NetR109_2: Microcontroller (U1.6), LTC-MTC Filtering (R109.2 TP33.1)
NetR118_2: Microcontroller (U1.83), User Control-Sliders (R118.2)
NetR120_2: Microcontroller (U1.82), User Control-Sliders (R120.2)
NetR129_2: Microcontroller (U1.81), User Control-Sliders (R129.2)
NetR130_2: Microcontroller (U1.80), User Control-Sliders (R130.2)
NetR143_2: Microcontroller (U1.76), High Voltage Converter (R143.2 R144.2)
NetR154_2: Microcontroller (U1.78), High Voltage Converter (R154.2 R155.2 TP12.1)
NetR159_2: Microcontroller (U1.69), High Voltage Converter (R159.2 R160.2)
NetU1_84: Microcontroller (U1.84), User Control-Sliders (U19.15)
NetU1_85: Microcontroller (U1.85), User Control-Sliders (U18.15)
NetU1_86: Microcontroller (U1.86), User Control-Sliders (U21.15)
NetU1_87: Microcontroller (U1.87), User Control-Sliders (U22.15)
RGB_~{RESET}: Microcontroller (R88.2), RGB Driver (R78.1 R81.1)
SCK: Microcontroller (R95.1), D1 (J5.1.1 U12.1.15), D2 (J5.2.1 U12.2.15), D3 (J5.3.1 U12.3.15), D4 (J5.4.1 U12.4.15), D5 (J5.5.1 U12.5.15), D6 (J5.6.1 U12.6.15), D7 (J5.7.1 U12.7.15), D8 (J5.8.1 U12.8.15), D9 (J5.9.1 U12.9.15)
SCL: Microcontroller (R87.1 U1.95), RGB Driver (U13.25 U15.25)
SDA: Microcontroller (R86.1 U1.96), RGB Driver (U13.26 U15.26)
SENSOR_MUX_0: Microcontroller (U1.93), User Control-Sliders (U18.10 U19.10 U21.10 U22.10)
SENSOR_MUX_1: Microcontroller (U1.92), User Control-Sliders (U18.11 U19.11 U21.11 U22.11)
SENSOR_MUX_2: Microcontroller (U1.91), User Control-Sliders (U18.14 U19.14 U21.14 U22.14)
SENSOR_MUX_3: Microcontroller (U1.90), User Control-Sliders (U18.13 U19.13 U21.13 U22.13)
SW_ISENSE_ADC: Microcontroller (U1.71), High Voltage Converter (C50.1 R45.2)
UV_SWITCH: Microcontroller (U1.65), Power_5v_3v3 (M4.1 U4.1)

## Assembly variants
Variant of Argon_RevB_PCBA: not fitted C13 R13 R21 R25 R29 R142 R145 R161